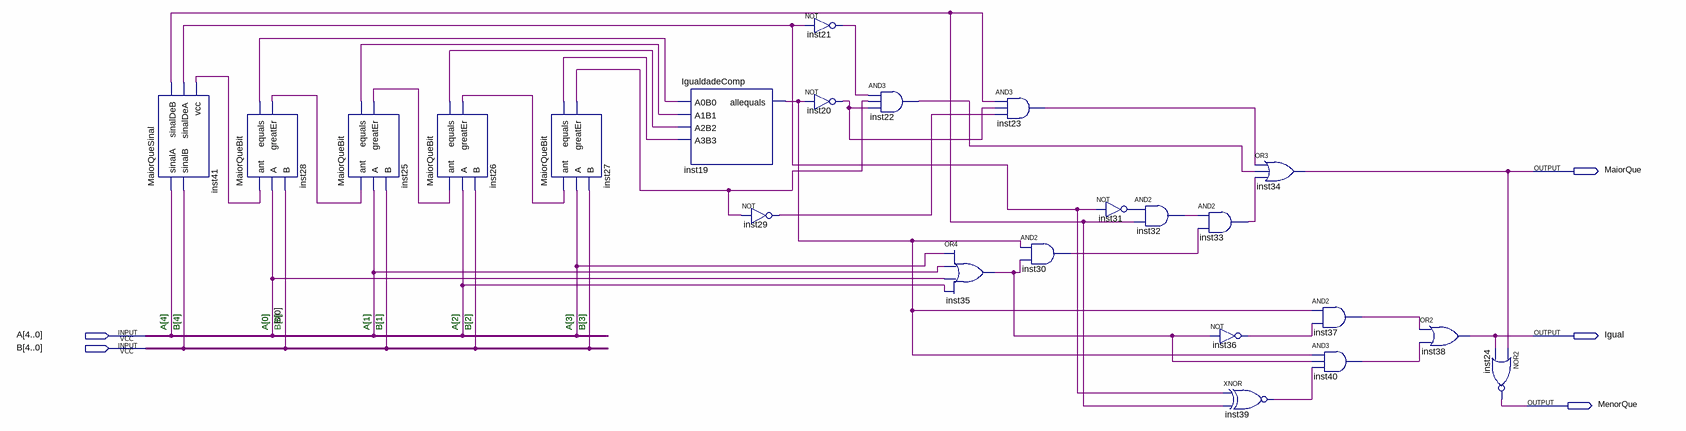
[diagram p0: schematic sheet]
// Quartus schematic Comparador.bdf as structural Verilog: 23 symbols, 5 pins
module Comparador (
  input  [4:0] A,
  input  [4:0] B,
  output MaiorQue,
  output Igual,
  output MenorQue
);

  wire inst19_allequals, inst20_out, inst21_out, inst22_out, inst23_out, inst25_equals, inst25_greater,
       inst26_equals, inst26_greater, inst27_equals, inst27_greater, inst28_equals, inst28_greater,
       inst29_out, inst30_out, inst31_out, inst32_out, inst33_out, inst35_out, inst36_out, inst37_out,
       inst39_out, inst40_out, inst41_sinaldea, inst41_sinaldeb, inst41_vcc;

  MaiorQueSinal inst41 (
    .sinalA(A[4]), .sinalB(B[4]), .sinalDeB(inst41_sinaldeb), .sinalDeA(inst41_sinaldea), .vcc(inst41_vcc));
  MaiorQueBit inst28 (.ant(inst41_vcc), .A(A[0]), .B(B[0]), .equals(inst28_equals), .greatEr(inst28_greater));
  MaiorQueBit inst25 (.ant(inst28_greater), .A(A[1]), .B(B[1]), .equals(inst25_equals), .greatEr(inst25_greater));
  MaiorQueBit inst26 (.ant(inst25_greater), .A(A[2]), .B(B[2]), .equals(inst26_equals), .greatEr(inst26_greater));
  MaiorQueBit inst27 (.ant(inst26_greater), .A(A[3]), .B(B[3]), .equals(inst27_equals), .greatEr(inst27_greater));
  IgualdadeComp inst19 (
    .A0B0(inst28_equals), .A1B1(inst25_equals), .A2B2(inst26_equals), .A3B3(inst27_equals),
    .allequals(inst19_allequals));
  not inst29 (inst29_out, inst27_greater);
  not inst21 (inst21_out, inst41_sinaldea);
  not inst20 (inst20_out, inst19_allequals);
  and inst22 (inst22_out, inst21_out, inst27_greater, inst20_out);
  or inst35 (inst35_out, A[3], A[1], A[0], A[2]);
  and inst23 (inst23_out, inst41_sinaldeb, inst20_out, inst29_out);
  and inst30 (inst30_out, inst19_allequals, inst35_out);
  not inst31 (inst31_out, inst41_sinaldea);
  and inst32 (inst32_out, inst31_out, inst41_sinaldeb);
  and inst33 (inst33_out, inst32_out, inst30_out);
  not inst36 (inst36_out, inst35_out);
  xnor inst39 (inst39_out, inst41_sinaldea, inst41_sinaldeb);
  or inst34 (MaiorQue, inst23_out, inst22_out, inst33_out);
  and inst37 (inst37_out, inst19_allequals, inst36_out);
  and inst40 (inst40_out, inst19_allequals, inst35_out, inst39_out);
  or inst38 (Igual, inst37_out, inst40_out);
  nor inst24 (MenorQue, MaiorQue, Igual);

  // Notes on the sheet:
  //   A[4]
  //   B[4]
  //   A[0]
  //   B[0]
  //   A[1]
  //   B[1]
  //   A[2]
  //   B[2]
  //   A[3]
  //   B[3]
endmodule
